# EAGLE design MiniDC (EAGLE 7.5.0)
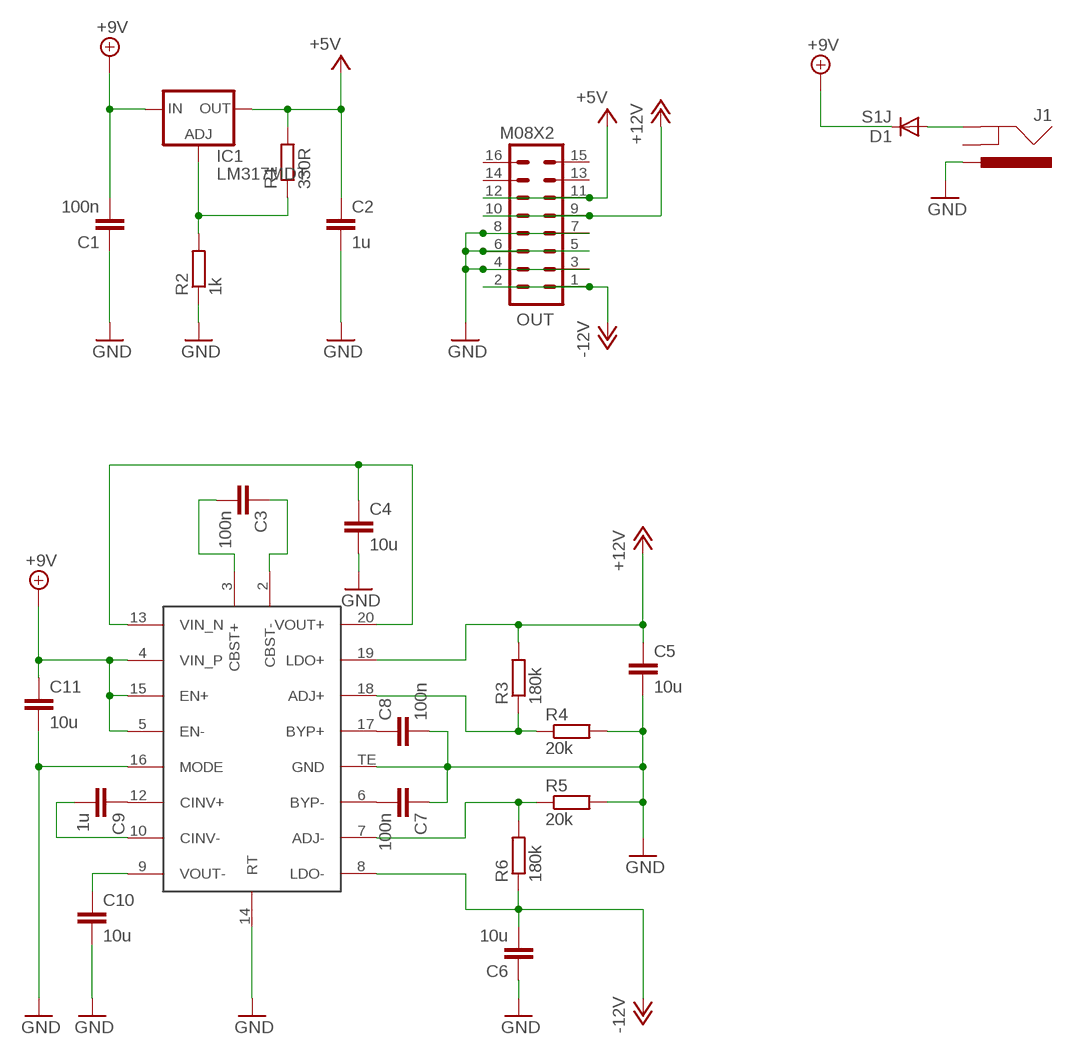
[diagram p0: schematic, sheet 1]

## Parts
C1  100n  C-EUC0603  [C0603]
C2  1u  C-EUC1206K  [C1206K]
C3  100n  C-EUC0603  [C0603]
C4  10u  C-EUC1206K  [C1206K]
C5  10u  C-EUC1206K  [C1206K]
C6  10u  C-EUC1206K  [C1206K]
C7  100n  C-EUC0603  [C0603]
C8  100n  C-EUC0603  [C0603]
C9  1u  C-EUC1206  [C1206]
C10  10u  C-EUC1206K  [C1206K]
C11  10u  C-EUC1206K  [C1206K]
D1  S1J  DIODESMA  [SMA-DIODE]
IC1  LM317MDT  [DPACK]
IC2  LTC3265  [TSSOP20-TE]
J1  POWER_JACKPTH  [POWER_JACK_PTH]
OUT  M08X2  [2X8]
R1  330R  R-EU_0603  [0603]
R2  1k  R-EU_0603  [0603]
R3  180k  R-EU_0603  [0603]
R4  20k  R-EU_0603  [0603]
R5  20k  R-EU_0603  [0603]
R6  180k  R-EU_0603  [0603]

## Nets
+5V: C2.1 IC1.4(OUT) OUT.11 OUT.12 R1.2
+9V: C1.2 C11.1 D1.C IC1.3(IN) IC2.4(VIN_P) IC2.5(EN-) IC2.15(EN+)
+12V: C5.1 IC2.19(LDO+) OUT.9 OUT.10 R3.2
-12V: C6.2 IC2.8(LDO-) OUT.1 OUT.2 R6.1
GND: C1.1 C2.2 C4.2 C5.2 C6.1 C7.1 C8.2 C10.2 C11.2 IC2.14(RT) IC2.16(MODE) IC2.TE(GND) J1.PWR OUT.3 OUT.4 OUT.5 OUT.6 OUT.7 OUT.8 R2.1 R4.2 R5.2
N$1: IC1.1(ADJ) R1.1 R2.2
N$2: C4.1 IC2.13(VIN_N) IC2.20(VOUT+)
N$4: C3.1 IC2.2(CBST-)
N$5: C3.2 IC2.3(CBST+)
N$6: C7.2 IC2.6(BYP-)
N$7: IC2.18(ADJ+) R3.1 R4.1
N$8: C8.1 IC2.17(BYP+)
N$9: C9.1 IC2.12(CINV+)
N$10: IC2.7(ADJ-) R5.1 R6.2
N$11: C10.1 IC2.9(VOUT-)
N$12: C9.2 IC2.10(CINV-)
N$13: D1.A J1.GND
Unconnected: J1.GNDBREAK OUT.13 OUT.14 OUT.15 OUT.16

## Library data of the parts
C1 C3 C7 C8 = rcl:C-EU: CAPACITOR, European symbol
C2 C4-C6 C9-C11 = Rebel:C-EU: CAPACITOR, European symbol
D1 = SparkFun:DIODE: Diode These are standard reverse protection diodes and small signal diodes. SMA package can handle up to about 1A. SOD-323 can handle about 200mA. What the SOD-323 package when ordering, there are some mfgs out there that are 5-pin packages.
IC1 = v-reg:LM317?*: 500 mA Adjustable Output Positive Voltage Regulator Source: http://www.onsemi.co.jp .. LM317M-D.PDF
IC2 = Rebel:LTC3265
J1 = SparkFun:POWER_JACK: Power Jack This is the standard 5.5mm barrel jack for power. The PTH is the most common, proven, reliable, footprint. All others are experimental. The Slot footprint only works if the mill layer is transmitted to the PCB fab house so be warned. Spark Fun Electronics SKU : PRT-00119. Mating wall wart : TOL-00298 (and others)
OUT = SparkFun:M08X2
R1-R6 = Rebel:R-EU_: RESISTOR, European symbol

## Board
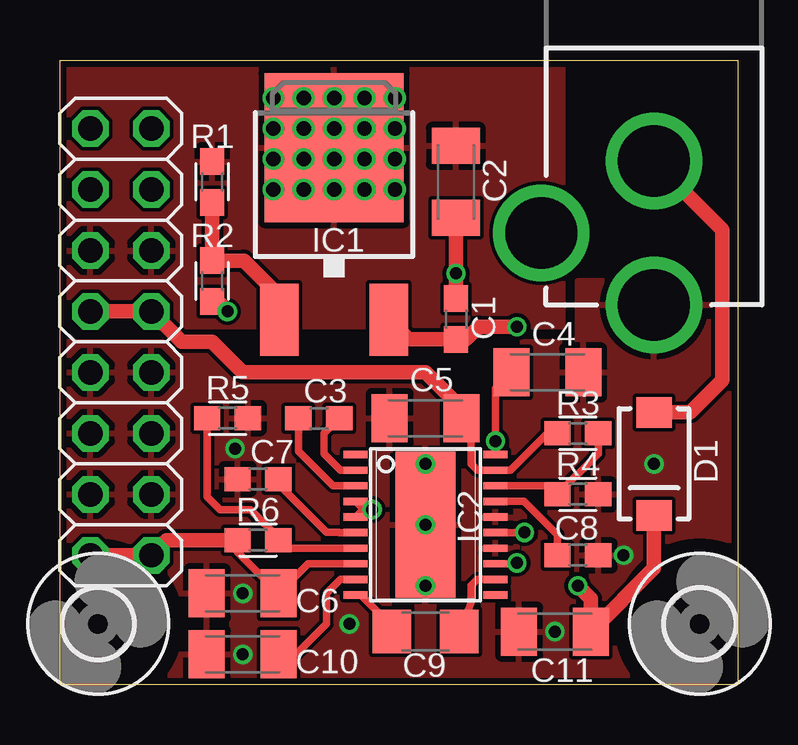
[diagram p1: board, top side]
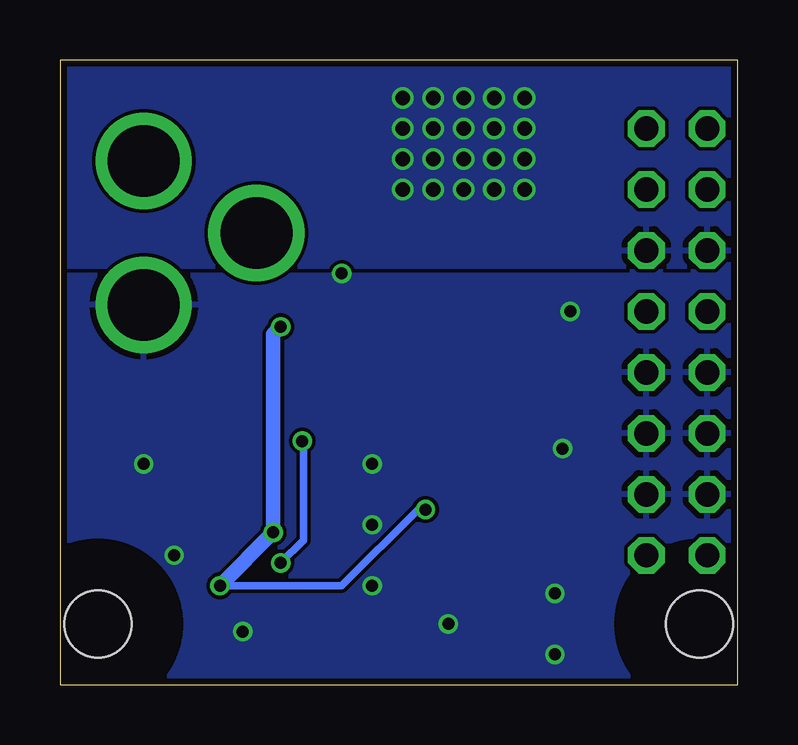
[diagram p2: board, bottom side, seen from below]

Size 28.26 x 26.04 mm. Coordinates in mm from the lower left corner, seen from the top.
Outline: 0,0 0,26.04 28.26,26.04 28.26,0 0,0
Copper layers (1*16): Top 0.035mm / dielectric 1.5mm / Bottom 0.035mm
Design rules "SeeedStudio_2layer_DRU_no_angle_20140221": minimum track width 6mil, minimum drill 12mil, track to track 6mil, track to pad 6mil, pad to pad 6mil, via to via 6mil, smd to smd 0mil, copper to edge 10mil, drill to drill 10mil, minimum pad ring 10mil, minimum via ring 6mil, stop-mask expansion 2mil, vias tented up to drill 100mil, thermal gap 10mil

### Footprints (pad centres in the part's own frame; a part is rotated, then mirrored left to right if it is on the bottom)
C0603 = smd 1.1 x 1: 1 -0.85,0; 2 0.85,0
C1206K = smd 1.5 x 2: 1 -1.5,0; 2 1.5,0
C1206 = smd 1.6 x 1.8: 1 -1.4,0; 2 1.4,0
SMA-DIODE = smd 1.27 x 1.47: A -2.15,0; C 2.15,0
DPACK = smd 1.6 x 3: 1 -2.28,-4.8; 3 2.28,-4.8 | smd 5.8 x 6.2: 4 0,2.38
TSSOP20-TE = smd 0.305 x 0.991: 1 -2.925,-2.918; 2 -2.275,-2.918; 3 -1.625,-2.918; 4 -0.975,-2.918; 5 -0.325,-2.918; 6 0.325,-2.918; 7 0.975,-2.918; 8 1.625,-2.918; 9 2.275,-2.918; 10 2.925,-2.918; 11 2.925,2.918; 12 2.275,2.918; 13 1.625,2.918; 14 0.975,2.918; 15 0.325,2.918; 16 -0.325,2.918; 17 -0.975,2.918; 18 -1.625,2.918; 19 -2.275,2.918; 20 -2.925,2.918 | smd 6.07 x 2.5: TE 0,0
POWER_JACK_PTH = drill 2.997: GND 0,7.7; GNDBREAK 4.7,10.7; PWR 0,13.7
2X8 = drill 1.016 octagon: 1 0,0; 2 0,2.54; 3 2.54,0; 4 2.54,2.54; 5 5.08,0; 6 5.08,2.54; 7 7.62,0; 8 7.62,2.54; 9 10.16,0; 10 10.16,2.54; 11 12.7,0; 12 12.7,2.54; 13 15.24,0; 14 15.24,2.54; 15 17.78,0; 16 17.78,2.54
0603 = smd 1.1 x 1: 1 -0.85,0; 2 0.85,0
2,8 = hole 2.8: 0,0

### Placement (x,y rotation side)
C1  16.51,15.24 270 top
C2  16.51,20.95 270 top
C3  10.8,11.11 180 top
C4  20.32,13.02 0 top
C5  15.24,11.11 180 top
C6  7.62,3.81 0 top
C7  8.25,8.57 0 top
C8  21.59,5.4 0 top
C9  15.24,2.22 180 top
C10  7.62,1.27 180 top
C11  20.64,2.22 180 top
D1  24.77,9.21 270 top
IC1  11.43,20 0 top
IC2  15.24,6.67 270 top
J1  24.77,29.53 180 top
OUT  3.81,5.4 90 top
R1  6.35,20.95 90 top
R2  6.35,16.83 90 top
R3  21.59,10.48 180 top
R4  21.59,7.94 0 top
R5  6.99,11.11 0 top
R6  8.25,6.03 0 top
U$2  [2,8]  26.67,2.54 0 top
U$3  [2,8]  1.59,2.54 0 top

### Tracks (layer width: path | path; a pad name or v marks a point on that pad's centre or on a via)
+5V  (via drill 0.6)
  other vias: 8.89,23.18 10.16,23.18 11.43,23.18 12.7,23.18 13.97,23.18 13.97,21.91 12.7,21.91 11.43,21.91 10.16,21.91 8.89,21.91 8.89,20.64 10.16,20.64 11.43,20.64 12.7,20.64 13.97,20.64 13.97,24.45 12.7,24.45 11.43,24.45 10.16,24.45 8.89,24.45
  pour Top: -1.27,14.92 -1.27,26.99 20.96,26.99 20.96,14.92
  pour Bottom: 0,17.46 0,28.26 30.48,28.26 30.48,17.46
+9V  (via drill 0.5)
  Top 0.305: IC2.15 19.06,6.34 v19.37,6.35 | 12.06,6.99 IC2.5 12.63,7.3 | v13.02,7.3 12.63,7.3 | 12.63,7.3 12.63,7.33 IC2.4
  Top 0.61: 13.97,15.98 IC1.3 14.52,14.39 C1.2 16.93,14.39 17.46,14.92 v19.05,14.92 | D1.C 24.77,4.85 C11.1 22.14,3.58 v21.59,4.13
  Bottom 0.305: v13.02,7.3 13.34,7.3 16.51,4.13 v21.59,4.13
  Bottom 0.61: v19.05,14.92 19.37,14.6 v19.37,6.35 v21.59,4.13
+12V
  Top 0.305: R3.2 20.32,10.48 18.79,8.94 IC2.19 17.41,8.94 17.14,9.21 17.14,10.71 C5.1
  Top 0.61: OUT.10 OUT.9 5.08,14.29 6.35,14.29 7.62,13.02 15.24,13.02 16.51,11.75 16.51,11.34 C5.1
-12V
  Top 0.305: IC2.8 10.35,5.04 C6.2 7.41,5.53 R6.1
  Top 0.61: R6.1 4.45,6.03 OUT.1 OUT.2
GND  (via drill 0.5)
  Top 0.61: R2.1 6.57,15.98 v6.99,15.56 | C2.2 v16.51,17.15 C1.1
  other vias: 20.64,2.22 24.77,9.21 12.07,2.54 7.62,1.27 7.3,9.84 15.24,4.13 15.24,9.21 15.24,6.67 23.5,5.4 7.62,3.81
  pour Bottom (rank 2): -2.54,-2.22 -2.54,29.53 31.75,29.53 31.75,-2.22
  pour Top: -1.27,-0.95 -1.27,14.29 21.59,14.29 21.59,16.83 30.48,16.83 30.48,-0.95
N$1
  Top 0.61: R1.1 R2.2 7.67,17.68 9.15,16.2 IC1.1
N$2  (via drill 0.5)
  Top 0.305: IC2.20 v18.16,10.16 18.16,12.36 C4.1 | IC2.13 19.01,5.04 v19.05,5.08
  Bottom 0.305: v19.05,5.08 18.1,6.03 18.1,10.1 v18.16,10.16
N$4
  Top 0.305: IC2.2 11.7,8.94 11.01,9.63 11.01,10.48 C3.1
N$5
  Top 0.305: IC2.3 11.39,8.29 9.95,9.74 C3.2
N$6
  Top 0.305: IC2.6 11.65,6.34 11.64,6.35 11.11,6.35 9.11,8.36 C7.2
N$7
  Top 0.305: IC2.18 20.39,8.29 R4.1 22.44,9.64 R3.1
N$8
  Top 0.305: IC2.17 19.35,7.64 20.74,6.25 C8.1
N$9
  Top 0.305: IC2.12 17.41,4.39 17.14,4.13 17.14,3.39 C9.1
N$10
  Top 0.305: IC2.7 9.45,5.69 R6.2 8.79,6.45 7.94,7.3 6.67,7.3 6.14,7.83 R5.1
N$11
  Top 0.305: IC2.9 11.7,4.39 11.11,3.81 11.11,2.54 9.84,1.27 C10.1
N$12
  Top 0.305: IC2.10 12.55,3.74 14.07,2.22 C9.2
N$13
  Top 0.61: J1.GND 27.62,18.97 27.62,12.7 26.28,11.36 D1.A

### Text on the board
Measures: -12v | -12v